# Altium schematic sheet Analog_Signal_Conditioning.SchDoc
size A
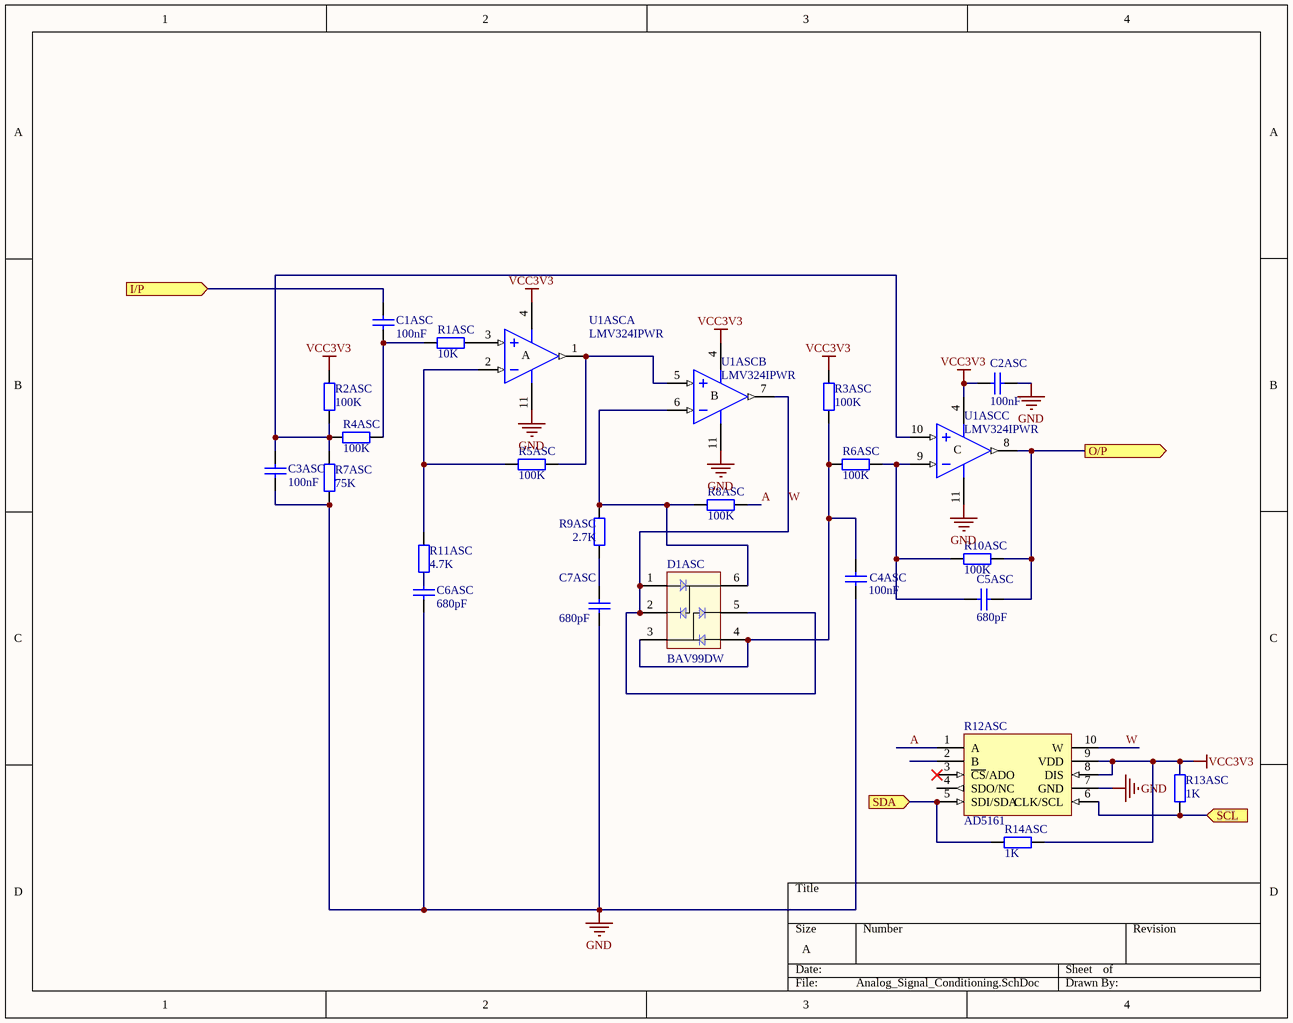
[diagram p0: Analog_Signal_Conditioning.SchDoc]

## Parts
C1ASC  value 100nF  [CC1608-0603]  (hidden comment: Cap)
C2ASC  value 100nF  [CC1608-0603]  (hidden comment: Cap)
C3ASC  value 100nF  [CC1608-0603]  (hidden comment: Cap)
C4ASC  value 100nF  [CC1608-0603]  (hidden comment: Cap)
C5ASC  value 680pF  [CC1608-0603]  (hidden comment: Cap)
C6ASC  value 680pF  [CC1608-0603]  (hidden comment: Cap)
C7ASC  value 680pF  [CC1608-0603]  (hidden comment: Cap)
D1ASC  BAV99DW-7-F  [SOT-323-6L]  (value not drawn)
R1ASC  value 10K  [CR1608-0603]  (hidden comment: Res)
R2ASC  value 100K  [CR1608-0603]  (hidden comment: Res)
R3ASC  value 100K  [CR1608-0603]  (hidden comment: Res)
R4ASC  value 100K  [CR1608-0603]  (hidden comment: Res)
R5ASC  value 100K  [CR1608-0603]  (hidden comment: Res)
R6ASC  value 100K  [CR1608-0603]  (hidden comment: Res)
R7ASC  value 75K  [CR1608-0603]  (hidden comment: Res)
R8ASC  value 100K  [CR1608-0603]  (hidden comment: Res)
R9ASC  value 2.7K  [CR1608-0603]  (hidden comment: Res)
R10ASC  value 100K  [CR1608-0603]  (hidden comment: Res)
R11ASC  value 4.7K  [CR1608-0603]  (hidden comment: Res)
R12ASC  AD5161  [TSSO3x5-G10]
R13ASC  value 1K  [CR1608-0603]  (hidden comment: Res)
R14ASC  value 1K  [CR1608-0603]  (hidden comment: Res)
U1ASC  LMV324IPWR  [TSSO5x6-G14/X.3]  (parts A,B,C of 4)

## Ports
I/P (in), O/P (out), SCL (in), SDA (in)

## Nets
GND: C2ASC.1 C3ASC.1 C4ASC.1 C6ASC.1 C7ASC.1 R7ASC.1 R12ASC.7(GND) U1ASC.11(V-)
VCC3V3: C2ASC.2 R2ASC.2 R3ASC.2 R12ASC.8(DIS) R12ASC.9(VDD) R13ASC.2 R14ASC.1 U1ASC.4(V+)
A: R8ASC.2 R12ASC.1(A)
I/P: C1ASC.2 ; port I/P
O/P: C5ASC.1 R10ASC.1 U1ASC.8(OUT) ; port O/P
SCL: R12ASC.6(CLK/SCL) R13ASC.1 ; port SCL
SDA: R12ASC.5(SDI/SDA) R14ASC.2 ; port SDA
W: D1ASC.1(A1) D1ASC.2(C1) D1ASC.5(C2) R12ASC.10(W) U1ASC.7(OUT)
NetC1ASC_1: C1ASC.1 R1ASC.2 R4ASC.1
NetC3ASC_2: C3ASC.2 R2ASC.1 R4ASC.2 R7ASC.2 U1ASC.10(IN+)
NetC4ASC_2: C4ASC.2 D1ASC.3(AC2) D1ASC.4(A2) R3ASC.1 R6ASC.2
NetC5ASC_2: C5ASC.2 R6ASC.1 R10ASC.2 U1ASC.9(IN-)
NetC6ASC_2: C6ASC.2 R11ASC.2
NetC7ASC_2: C7ASC.2 R9ASC.1
NetD1ASC_6: D1ASC.6(AC1) R8ASC.1 R9ASC.2 U1ASC.6(IN-)
NetR1ASC_1: R1ASC.1 U1ASC.3(IN+)
NetR5ASC_1: R5ASC.1 U1ASC.1(OUT) U1ASC.5(IN+)
NetR5ASC_2: R5ASC.2 R11ASC.1 U1ASC.2(IN-)

Not connected (* = marked no-connect by the designer): R12ASC 2(B) 3(~{CS}/ADO)* 4(SDO/NC)

## Notes on the sheet
- (in symbol LMV324IPWR, part A) A
- (in symbol LMV324IPWR, part B) B
- (in symbol LMV324IPWR, part C) C

## Library data of the parts
C1ASC C2ASC C3ASC C4ASC C5ASC C6ASC C7ASC = Cap: Capacitor
D1ASC = BAV99DW: Quad surface mount switching diode array; Manufacturer: Diodes Incorporated; Distributor: DigiKey; OrderCode: BAV99DW-7-F
R1ASC R2ASC R3ASC R4ASC R5ASC R6ASC R7ASC R8ASC R9ASC R10ASC R11ASC R13ASC R14ASC = Res: Resistor; Distributor: Digikey
R12ASC = AD5161_3x5: AD5161 SPI/I2C Selectable Digital Potentiometer; Manufacturer: Analog Devices; OrderCode: AD5161BRMZ50-ND; Distributor: Digikey
U1ASC = LMV324IPWR: Rail-to-Rail Operational Amplifier; Manufacturer: Texas Instruments; Distributor: Digikey; OrderCode: LMV324IPWR